# EAGLE schematic RectifierPart (EAGLE 9.6.2)
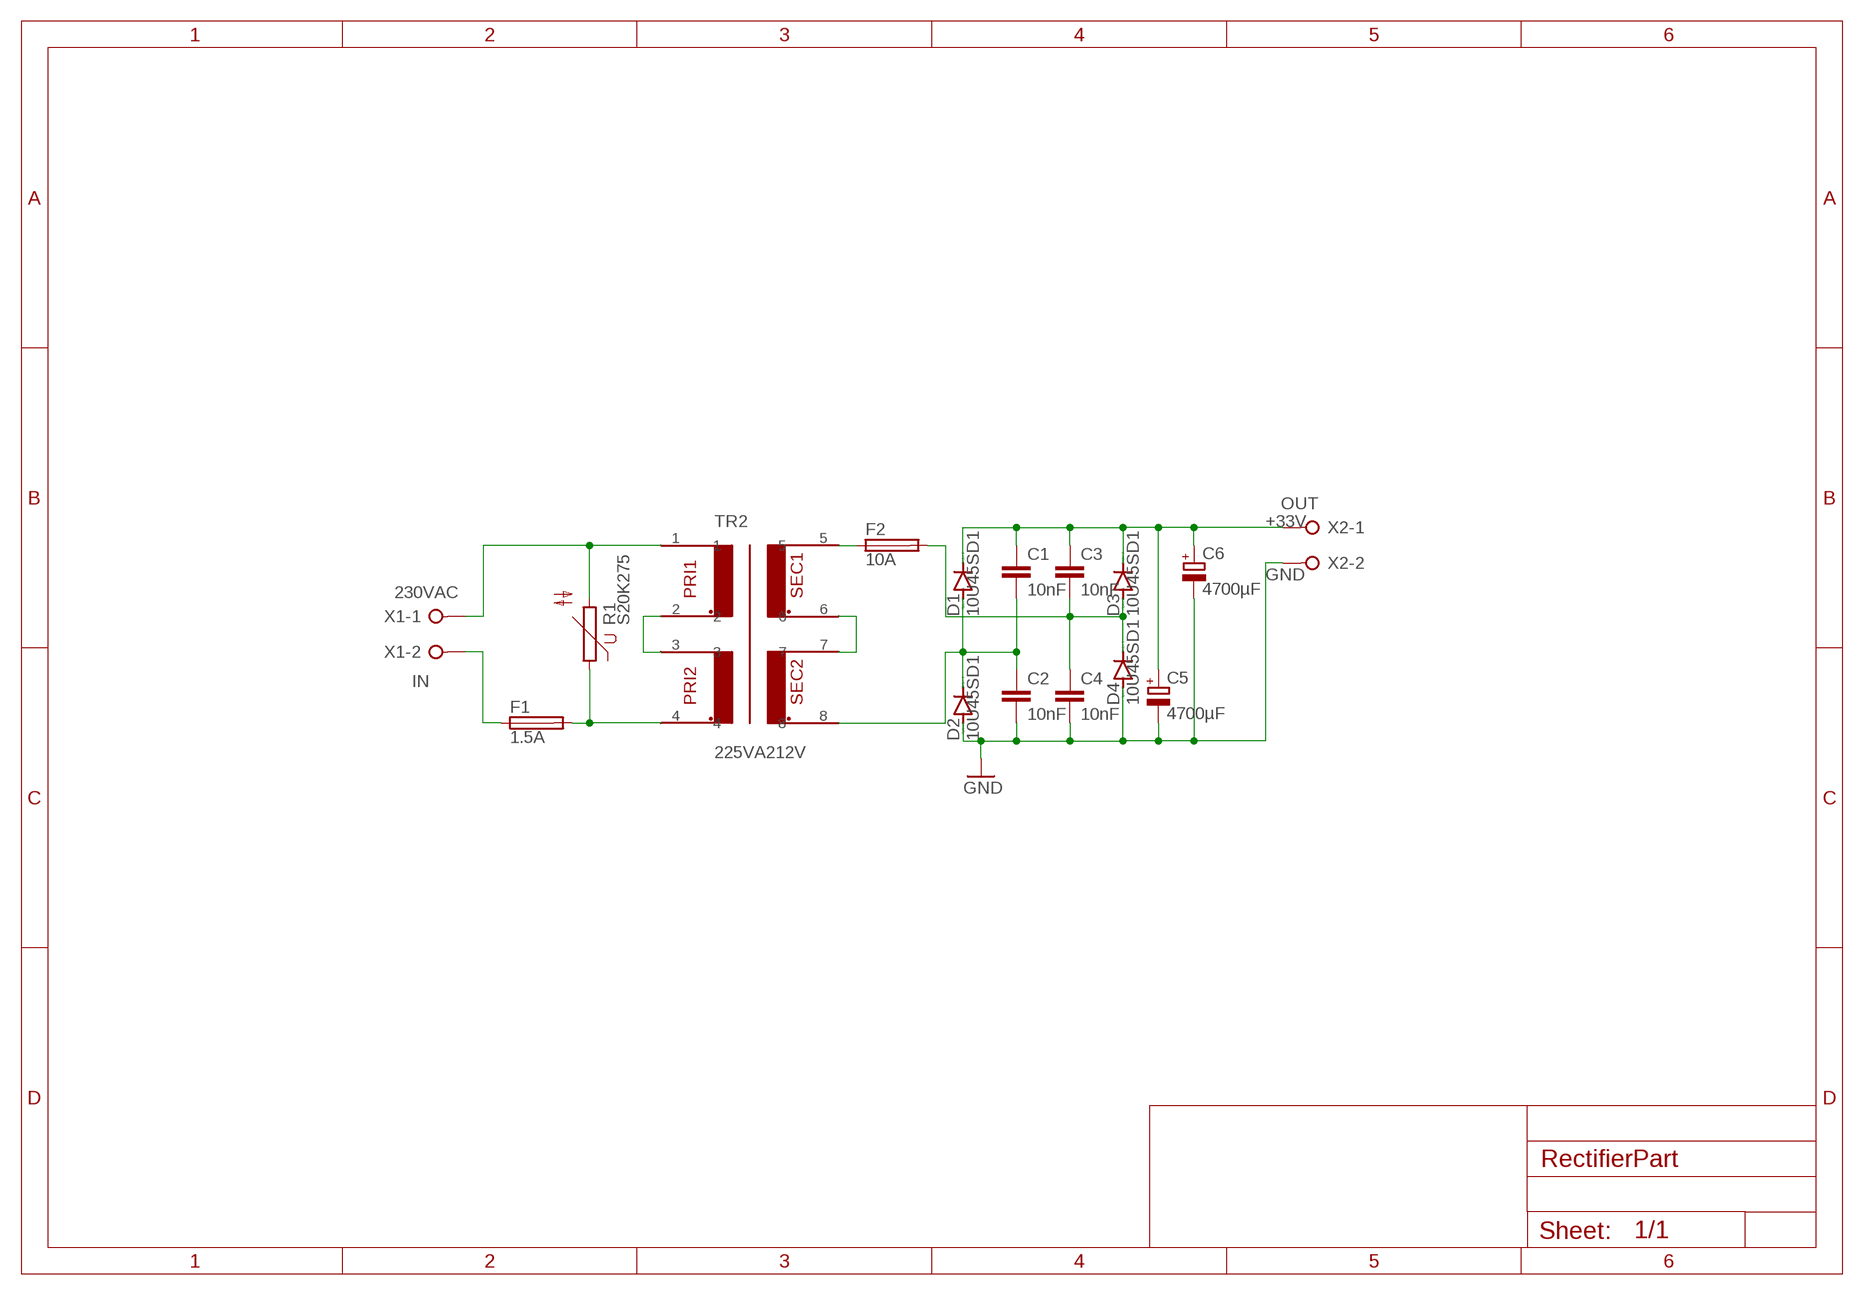
[diagram p0: schematic, sheet 1]

## Parts
C1  10nF  C-EU050-024X044  [C050-024X044]
C2  10nF  C-EU050-024X044  [C050-024X044]
C3  10nF  C-EU050-024X044  [C050-024X044]
C4  10nF  C-EU050-024X044  [C050-024X044]
C5  4700µF  CPOL-EUE5-13  [E5-13]
C6  4700µF  CPOL-EUE5-13  [E5-13]
D1  10U45SD1  1N5400  [DO201-15]
D2  10U45SD1  1N5400  [DO201-15]
D3  10U45SD1  1N5400  [DO201-15]
D4  10U45SD1  1N5400  [DO201-15]
F1  1.5A  SH22,5  [SH22,5]
F2  10A  SH22,5  [SH22,5]
R1  S20K275  [S20K275]
TR2  225VA212V  [RKD225-2X12]
X1  IN  W237-02P  [W237-132]
X2  OUT  W237-02P  [W237-132]

## Nets
230VAC: R1.2 TR2.1 X1.1
+33V: C1.1 C3.1 C5.+ C6.+ D1.C D3.C X2.1
GND: C2.2 C4.2 C5.- C6.- D2.A D4.A X2.2
N$1: C3.2 C4.1 D3.A D4.C F2.2
N$2: F2.1 TR2.5
N$3: TR2.2 TR2.3
N$4: C1.2 C2.1 D1.A D2.C TR2.8
N$5: F1.1 X1.2
N$6: F1.2 R1.1 TR2.4
N$8: TR2.6 TR2.7

## Library data of the parts
C1-C4 = rcl:C-EU: CAPACITOR, European symbol; SPICEPREFIX: C
C5 C6 = rcl:CPOL-EU: POLARIZED CAPACITOR, European symbol; SPICEPREFIX: C
D1-D4 = diode:1N5400: DIODE standard rectifier, 3 A, 50 V (Motorola)
F1 F2 = fuse:SH22,5: FUSE HOLDER grid 22,5 mm, OGN0031 8201, Schurter (Buerklin); MF: SCHURTER; MPN: 0031.8201; OC_FARNELL: 1162740; OC_NEWARK: 96F8317
R1 = varistor:S20K275: VARISTOR
TR2 = bb84:225VA212V
X1 X2 = con-wago-508:W237-02P: WAGO SREW CLAMP; OC_FARNELL: unknown; OC_NEWARK: unknown